# Altium schematic sheet XMini.SchDoc
size B
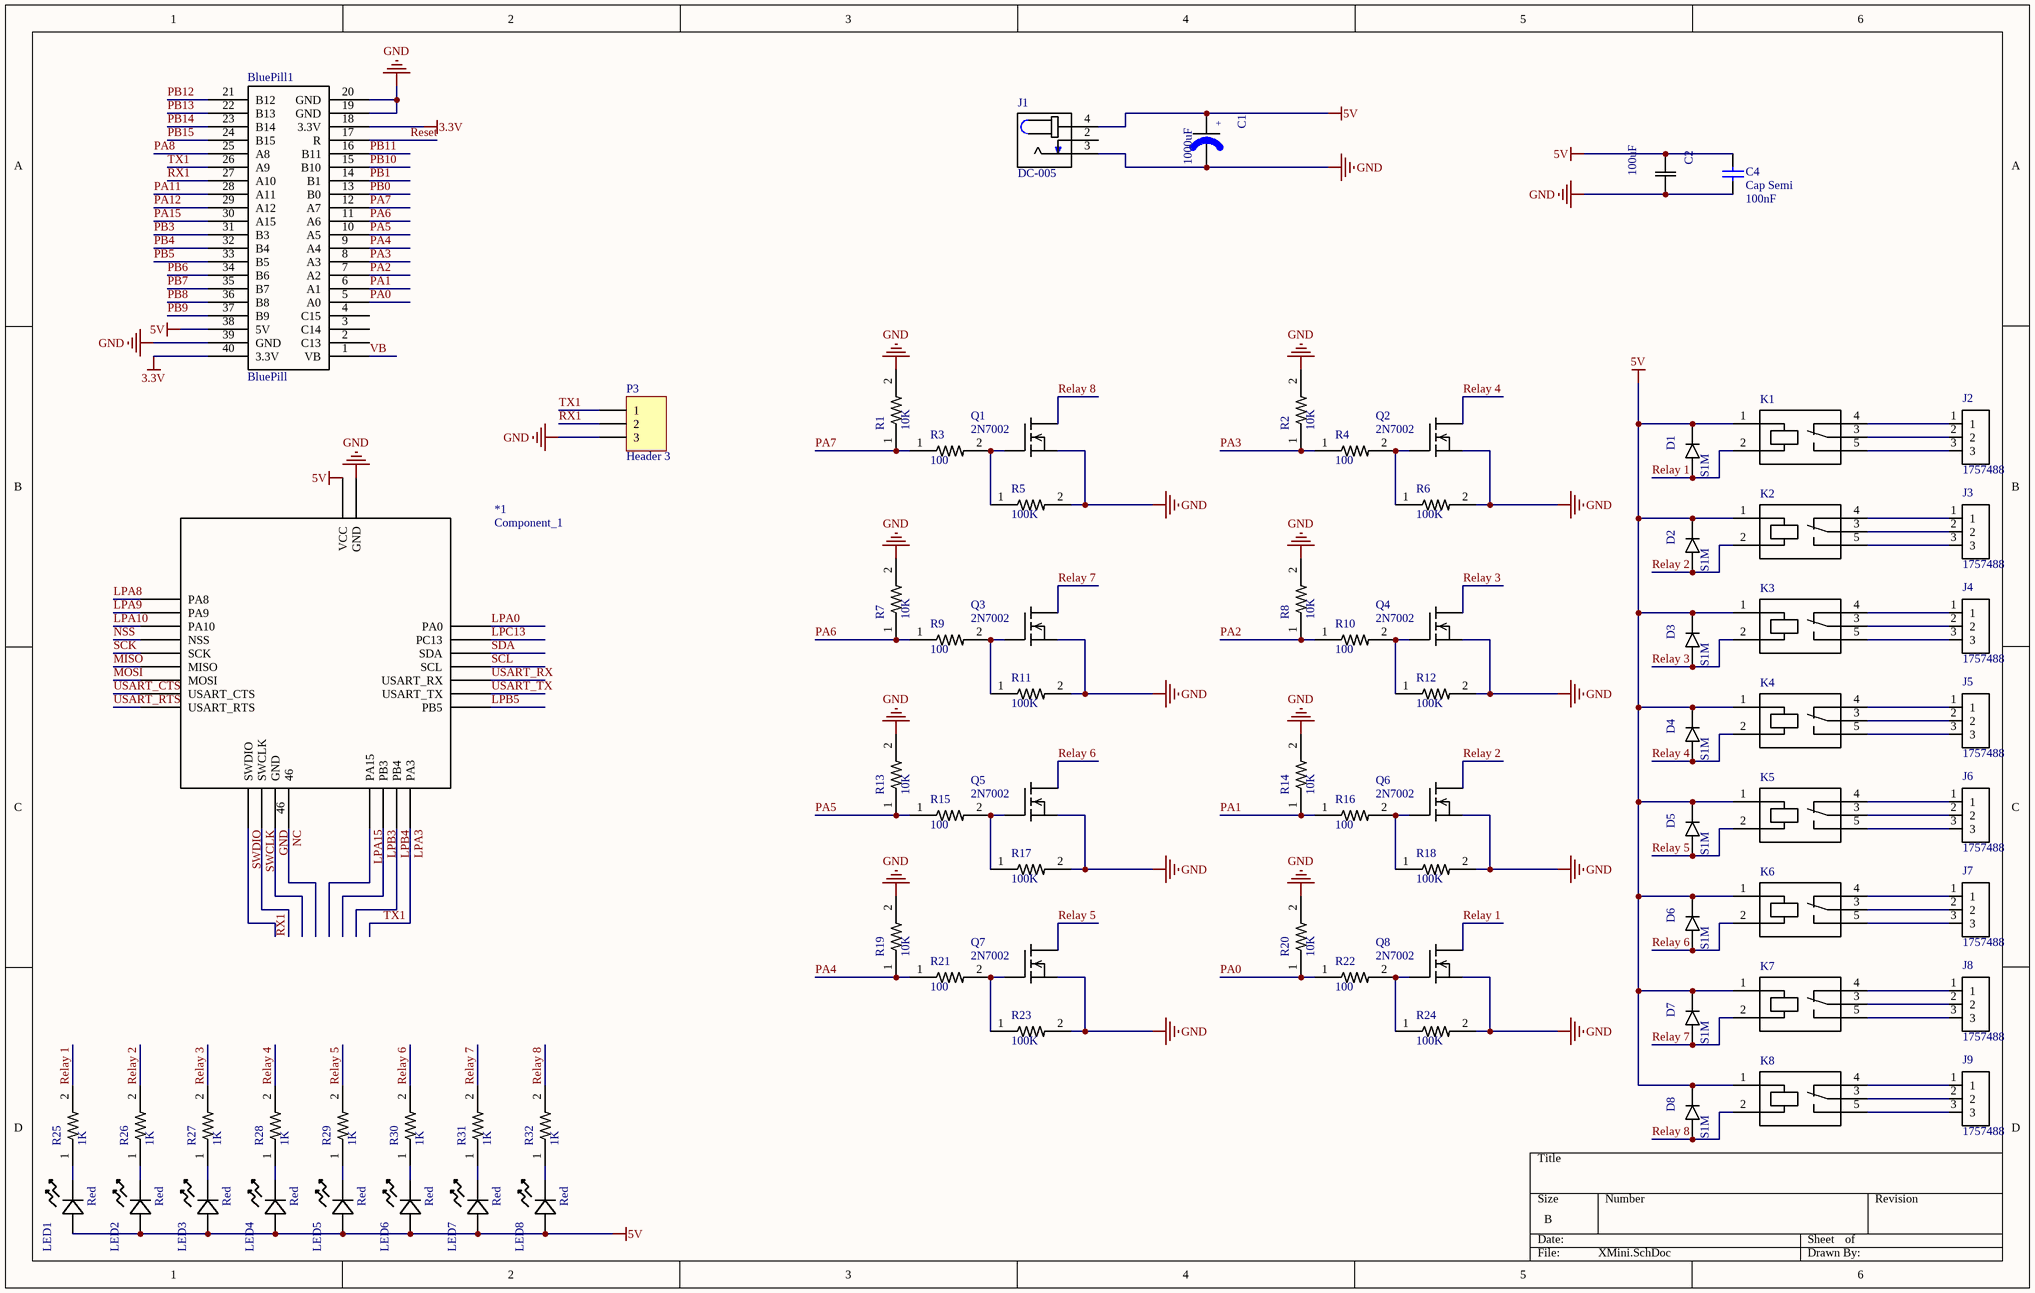
[diagram p0: XMini.SchDoc]

## Parts
*1  Component_1  [Lora_Board]
BluePill1  BluePill  [stm32 Blue pill]
C1  1000uF  [*CAPAE1030X1050N]
C2  100uF  [*CAPCP7343X430N]
C4  Cap Semi  value 100nF  [C1206]
D1  S1M  [SMD Diode*DIOM5227X270NSMD DiodeS1MSMD DiodePrimarySMD Diode]
D2  S1M  [SMD Diode*DIOM5227X270NSMD DiodeS1MSMD DiodePrimarySMD Diode]
D3  S1M  [SMD Diode*DIOM5227X270NSMD DiodeS1MSMD DiodePrimarySMD Diode]
D4  S1M  [SMD Diode*DIOM5227X270NSMD DiodeS1MSMD DiodePrimarySMD Diode]
D5  S1M  [SMD Diode*DIOM5227X270NSMD DiodeS1MSMD DiodePrimarySMD Diode]
D6  S1M  [SMD Diode*DIOM5227X270NSMD DiodeS1MSMD DiodePrimarySMD Diode]
D7  S1M  [SMD Diode*DIOM5227X270NSMD DiodeS1MSMD DiodePrimarySMD Diode]
D8  S1M  [SMD Diode*DIOM5227X270NSMD DiodeS1MSMD DiodePrimarySMD Diode]
J1  DC-005  [*NINIGI_DC-005]
J2  1757488  [*PHOENIX_1757488]
J3  1757488  [*PHOENIX_1757488]
J4  1757488  [*PHOENIX_1757488]
J5  1757488  [*PHOENIX_1757488]
J6  1757488  [*PHOENIX_1757488]
J7  1757488  [*PHOENIX_1757488]
J8  1757488  [*PHOENIX_1757488]
J9  1757488  [*PHOENIX_1757488]
K1  1-1721150-0  [*TE_ORWH-SH-105D1F,000]  (value not drawn)
K2  1-1721150-0  [*TE_ORWH-SH-105D1F,000]  (value not drawn)
K3  1-1721150-0  [*TE_ORWH-SH-105D1F,000]  (value not drawn)
K4  1-1721150-0  [*TE_ORWH-SH-105D1F,000]  (value not drawn)
K5  1-1721150-0  [*TE_ORWH-SH-105D1F,000]  (value not drawn)
K6  1-1721150-0  [*TE_ORWH-SH-105D1F,000]  (value not drawn)
K7  1-1721150-0  [*TE_ORWH-SH-105D1F,000]  (value not drawn)
K8  1-1721150-0  [*TE_ORWH-SH-105D1F,000]  (value not drawn)
LED1  Red  [*LED_597-3111-407F]
LED2  Red  [*LED_597-3111-407F]
LED3  Red  [*LED_597-3111-407F]
LED4  Red  [*LED_597-3111-407F]
LED5  Red  [*LED_597-3111-407F]
LED6  Red  [*LED_597-3111-407F]
LED7  Red  [*LED_597-3111-407F]
LED8  Red  [*LED_597-3111-407F]
P3  Header 3  [HDR1X3]
Q1  2N7002  [*SOT23]
Q2  2N7002  [*SOT23]
Q3  2N7002  [*SOT23]
Q4  2N7002  [*SOT23]
Q5  2N7002  [*SOT23]
Q6  2N7002  [*SOT23]
Q7  2N7002  [*SOT23]
Q8  2N7002  [*SOT23]
R1  10K  [*RESC3116X65N]
R2  10K  [*RESC3116X65N]
R3  100  [*RESC3116X65N]
R4  100  [*RESC3116X65N]
R5  100K  [*RESC3116X65N]
R6  100K  [*RESC3116X65N]
R7  10K  [*RESC3116X65N]
R8  10K  [*RESC3116X65N]
R9  100  [*RESC3116X65N]
R10  100  [*RESC3116X65N]
R11  100K  [*RESC3116X65N]
R12  100K  [*RESC3116X65N]
R13  10K  [*RESC3116X65N]
R14  10K  [*RESC3116X65N]
R15  100  [*RESC3116X65N]
R16  100  [*RESC3116X65N]
R17  100K  [*RESC3116X65N]
R18  100K  [*RESC3116X65N]
R19  10K  [*RESC3116X65N]
R20  10K  [*RESC3116X65N]
R21  100  [*RESC3116X65N]
R22  100  [*RESC3116X65N]
R23  100K  [*RESC3116X65N]
R24  100K  [*RESC3116X65N]
R25  1K  [*RESC3116X65N]
R26  1K  [*RESC3116X65N]
R27  1K  [*RESC3116X65N]
R28  1K  [*RESC3116X65N]
R29  1K  [*RESC3116X65N]
R30  1K  [*RESC3116X65N]
R31  1K  [*RESC3116X65N]
R32  1K  [*RESC3116X65N]

## Nets
3.3V: BluePill1.18(3.3V) BluePill1.40(3.3V)
5V: *1.VCC BluePill1.38(5V) C1.1 C2.1(C1) C4.2 D1.C(K) D2.C(K) D3.C(K) D4.C(K) D5.C(K) D6.C(K) D7.C(K) D8.C(K) J1.4 K1.1(C1) K2.1(C1) K3.1(C1) K4.1(C1) K5.1(C1) K6.1(C1) K7.1(C1) K8.1(C1) LED1.2 LED2.2 LED3.2 LED4.2 LED5.2 LED6.2 LED7.2 LED8.2
GND: *1.GND BluePill1.19(GND) BluePill1.20(GND) BluePill1.39(GND) C1.2 C2.2(C2) C4.1 J1.3 P3.3 Q1.2(S) Q2.2(S) Q3.2(S) Q4.2(S) Q5.2(S) Q6.2(S) Q7.2(S) Q8.2(S) R1.2 R2.2 R5.2 R6.2 R7.2 R8.2 R11.2 R12.2 R13.2 R14.2 R17.2 R18.2 R19.2 R20.2 R23.2 R24.2
LPA0: *1.PA0
LPA3: *1.PA3 BluePill1.26(A9) P3.1  [also labelled TX1]
LPA8: *1.PA8
LPA9: *1.PA9
LPA10: *1.PA10
LPA15: *1.PA15
LPB3: *1.PB3
LPB4: *1.PB4
LPB5: *1.PB5
LPC13: *1.PC13
MISO: *1.MISO
MOSI: *1.MOSI
NC: *1.46
NSS: *1.NSS
PA0: BluePill1.5(A0) R20.1 R22.1
PA1: BluePill1.6(A1) R14.1 R16.1
PA2: BluePill1.7(A2) R8.1 R10.1
PA3: BluePill1.8(A3) R2.1 R4.1
PA4: BluePill1.9(A4) R19.1 R21.1
PA5: BluePill1.10(A5) R13.1 R15.1
PA6: BluePill1.11(A6) R7.1 R9.1
PA7: BluePill1.12(A7) R1.1 R3.1
PA8: BluePill1.25(A8)
PA11: BluePill1.28(A11)
PA12: BluePill1.29(A12)
PA15: BluePill1.30(A15)
PB0: BluePill1.13(B0)
PB1: BluePill1.14(B1)
PB3: BluePill1.31(B3)
PB4: BluePill1.32(B4)
PB5: BluePill1.33(B5)
PB6: BluePill1.34(B6)
PB7: BluePill1.35(B7)
PB8: BluePill1.36(B8)
PB9: BluePill1.37(B9)
PB10: BluePill1.15(B10)
PB11: BluePill1.16(B11)
PB12: BluePill1.21(B12)
PB13: BluePill1.22(B13)
PB14: BluePill1.23(B14)
PB15: BluePill1.24(B15)
Relay 1: D1.A K1.2(C2) Q8.3(D) R25.2
Relay 2: D2.A K2.2(C2) Q6.3(D) R26.2
Relay 3: D3.A K3.2(C2) Q4.3(D) R27.2
Relay 4: D4.A K4.2(C2) Q2.3(D) R28.2
Relay 5: D5.A K5.2(C2) Q7.3(D) R29.2
Relay 6: D6.A K6.2(C2) Q5.3(D) R30.2
Relay 7: D7.A K7.2(C2) Q3.3(D) R31.2
Relay 8: D8.A K8.2(C2) Q1.3(D) R32.2
Reset: BluePill1.17(R)
RX1: *1.SWCLK BluePill1.27(A10) P3.2  [also labelled SWCLK]
SCK: *1.SCK
SCL: *1.SCL
SDA: *1.SDA
SWDIO: *1.SWDIO
USART_CTS: *1.USART_CTS
USART_RTS: *1.USART_RTS
USART_RX: *1.USART_RX
USART_TX: *1.USART_TX
VB: BluePill1.1(VB)
NetJ2_1: J2.1 K1.4(NC)
NetJ2_2: J2.2 K1.3(C)
NetJ2_3: J2.3 K1.5(NO)
NetJ3_1: J3.1 K2.4(NC)
NetJ3_2: J3.2 K2.3(C)
NetJ3_3: J3.3 K2.5(NO)
NetJ4_1: J4.1 K3.4(NC)
NetJ4_2: J4.2 K3.3(C)
NetJ4_3: J4.3 K3.5(NO)
NetJ5_1: J5.1 K4.4(NC)
NetJ5_2: J5.2 K4.3(C)
NetJ5_3: J5.3 K4.5(NO)
NetJ6_1: J6.1 K5.4(NC)
NetJ6_2: J6.2 K5.3(C)
NetJ6_3: J6.3 K5.5(NO)
NetJ7_1: J7.1 K6.4(NC)
NetJ7_2: J7.2 K6.3(C)
NetJ7_3: J7.3 K6.5(NO)
NetJ8_1: J8.1 K7.4(NC)
NetJ8_2: J8.2 K7.3(C)
NetJ8_3: J8.3 K7.5(NO)
NetJ9_1: J9.1 K8.4(NC)
NetJ9_2: J9.2 K8.3(C)
NetJ9_3: J9.3 K8.5(NO)
NetLED1_1: LED1.1 R25.1
NetLED2_1: LED2.1 R26.1
NetLED3_1: LED3.1 R27.1
NetLED4_1: LED4.1 R28.1
NetLED5_1: LED5.1 R29.1
NetLED6_1: LED6.1 R30.1
NetLED7_1: LED7.1 R31.1
NetLED8_1: LED8.1 R32.1
NetQ1_1: Q1.1(G) R3.2 R5.1
NetQ2_1: Q2.1(G) R4.2 R6.1
NetQ3_1: Q3.1(G) R9.2 R11.1
NetQ4_1: Q4.1(G) R10.2 R12.1
NetQ5_1: Q5.1(G) R15.2 R17.1
NetQ6_1: Q6.1(G) R16.2 R18.1
NetQ7_1: Q7.1(G) R21.2 R23.1
NetQ8_1: Q8.1(G) R22.2 R24.1

Not connected (* = marked no-connect by the designer): BluePill1 2(C13) 3(C14) 4(C15); J1 2(4)

## Notes on the sheet
- (in symbol HZA107M050G24T-F) +

## Library data of the parts
BluePill1 = Stm32BluePill: Blue Pill Module
C1 = HZA107M050G24T-F: Cap Aluminum Polymer Hybrid 100uF 50VDC 20% _10 X 10.2mm_ SMD 0.028 Ohm 2000mA 10000h 105C Automotive T/R; MF: Cornell Dubilier; SnapEDA_Link: https://www.snapeda.com/parts/HZA107M050G24T-F/Cornell%20Dubilier%20Electronics%20%28CDE%29/view-part/?ref=snap; Availability: Unavailable; Price: None; Package: Radial Cornell Dubilier; MP: HZA107M050G24T-F; Value: *
C2 = TAJE337K006R: Capacitor tantalum TAJ 2717 330uF 6.3V; MF: AVX; Availability: Unavailable; Package: None; Price: None; SnapEDA_Link: https://www.snapeda.com/parts/TAJE337K006R/AVX/view-part/?ref=snap; MP: TAJE337K006R; Value: *
C4 = Cap Semi: Capacitor (Semiconductor SIM Model); Published: 8-Jun-2000; LatestRevisionDate: 29-May-2009; LatestRevisionNote: IPC-7351 Footprint Added.; PackageReference: C1206; Publisher: Altium Limited; PackageDescription: Chip Capacitor
D1-D8 = S1M: S1 Series 1000 V 1 A 1 uA Surface Mount General Purpose Rectifier - DO-214AC; MF: ON Semiconductor; MP: S1M; SnapEDA_Link: https://www.snapeda.com/parts/S1M/ON%20Semiconductor/view-part/?ref=snap; Package: DO-214AC-214 ON Semiconductor; Price: None; Availability: Unavailable; Value: *
J1 = DC-005: MF: Littelfuse Inc.; SnapEDA_Link: https://www.snapeda.com/parts/DC-005/Littelfuse%20Inc./view-part/?ref=snap; Availability: Unavailable; Price: None; MP: DC-005; Package: 0603 Ninigi; Value: *
J2-J9 = 1757488: Conn; TermBlk; PCB; Header; SnglLvl; 90DegAngl; Sldr; 3Pole; 5mmPitch; COMBICON; MF: Phoenix Contact; SnapEDA_Link: https://www.snapeda.com/parts/1757488/Phoenix%20Contact/view-part/?ref=snap; Package: None; MP: 1757488; Availability: Unavailable; Price: None; Value: *
K1-K8 = ORWH-SH-105D1F,000: General Purpose Relay, ORWH Series, Power, Non Latching, SPDT, 5 VDC, 10 A; MF: TE Connectivity; SnapEDA_Link: https://www.snapeda.com/parts/ORWH-SH-105D1F%2C000/TE%20Connectivity%20Potter%20%26%20Brumfield%20Relays/view-part/?ref=snap; Availability: Unavailable; TE_purchase_URL: https://www.te.com/usa-en/product-1-1721150-0.html?te_bu=Cor&te_type=disp&te_campaign=seda_glo_cor-seda-global-disp-prtnr-fy19-seda-model-bom-cta_sma-317_1&elqCampaignId=32493; Package: None; Price: None; MP: ORWH-SH-105D1F,000; Value: *
LED1-LED8 = 597-3111-407F: LED RED CLEAR 1206 SMD; MF: Dialight; MP: 5973111407F; Package: 1206 Dialight; Availability: Unavailable; Price: None; SnapEDA_Link: https://www.snapeda.com/parts/5973111407F/Dialight/view-part/?ref=snap; Value: *
P3 = Header 3: Header, 3-Pin; LatestRevisionDate: 17-Jul-2002; LatestRevisionNote: Re-released for DXP Platform.; Publisher: Altium Limited
Q1-Q8 = 2N7002: Transistor NPN Mos 2N7002 SILICONIX miliampere=100 V=60 SOt23; MF: STMicroelectronics; MP: 2N7002; Price: None; Package: SOT-23-3 Vishay; Availability: Unavailable; SnapEDA_Link: https://www.snapeda.com/parts/2N7002/STMicroelectronics/view-part/?ref=snap; Value: *
R1-R32 = RT1206DRE07120KL: Res Smd 120k Ohm 0.5% 1/8w 1206; MF: Yageo; Package: 1206 Yageo; Availability: Unavailable; Price: None; SnapEDA_Link: https://www.snapeda.com/parts/RT1206DRE07120KL/Yageo/view-part/?ref=snap; MP: RT1206DRE07120KL; Value: *